# EAGLE design dfine_xb_v15_3relay (EAGLE 5.06)
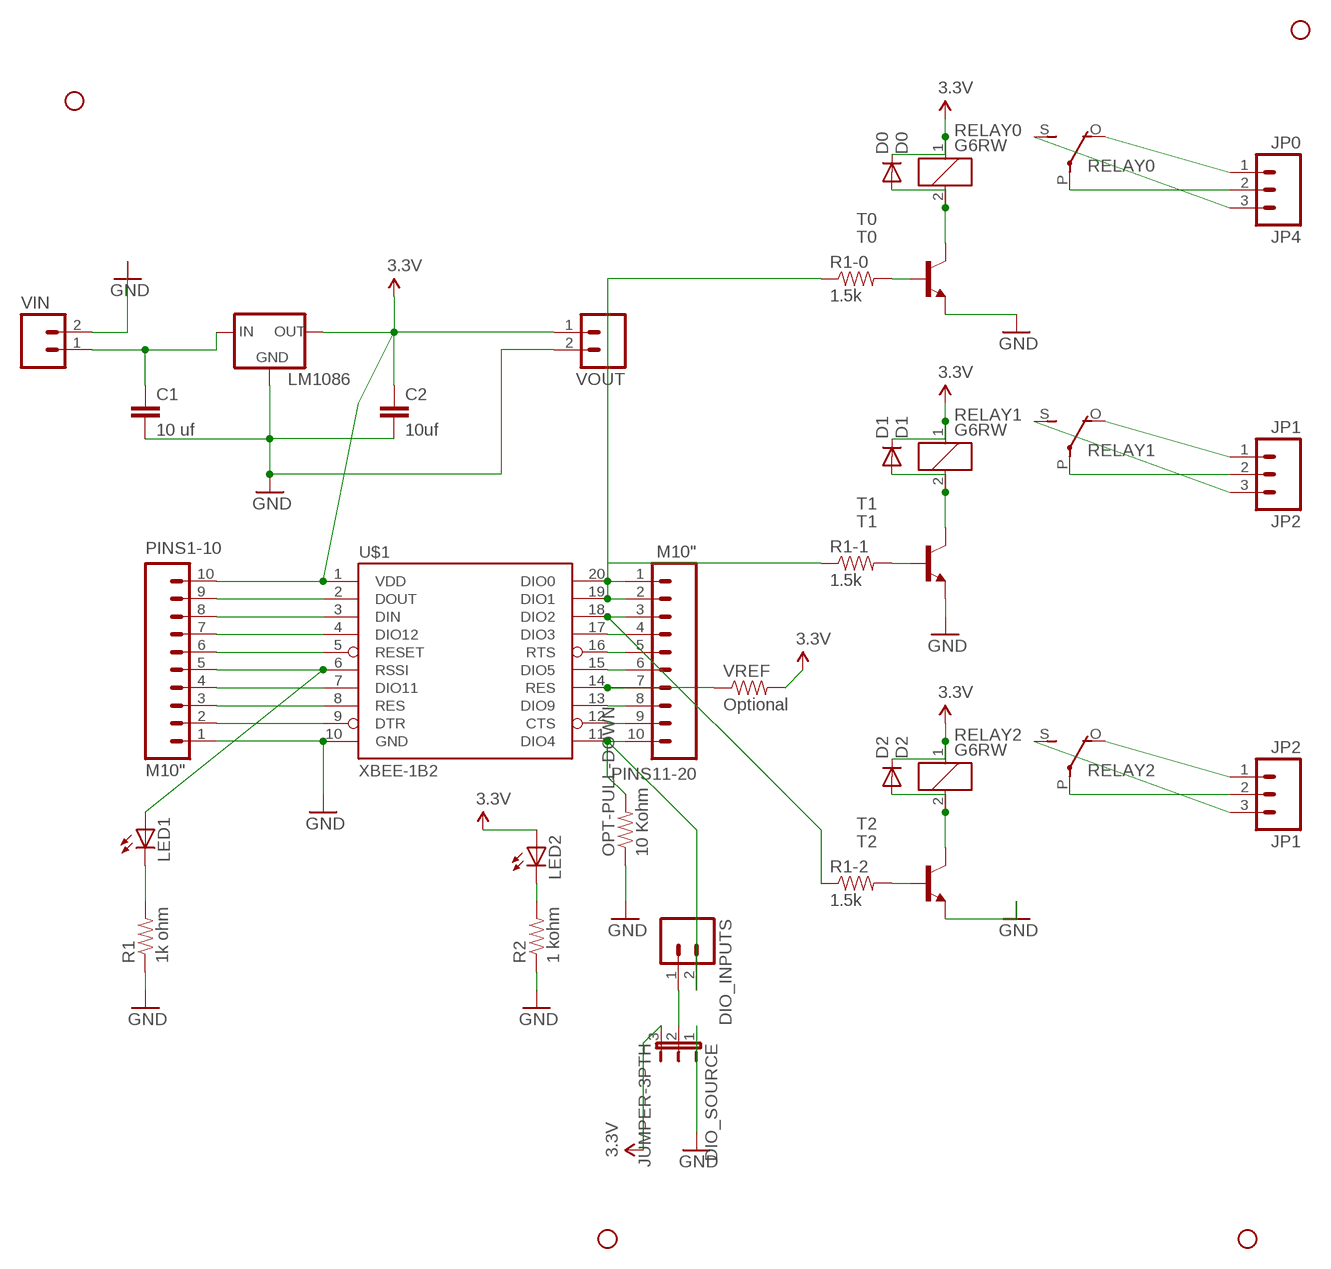
[diagram p0: schematic, sheet 1]

## Parts
C1  10 uf  CAPPTH  [CAP-PTH-SMALL]
C2  10uf  CAPPTH  [CAP-PTH-SMALL]
D0  D0  DIODEPTH  [DIODE-1N4001]
D1  D1  DIODEPTH  [DIODE-1N4001]
D2  D2  DIODEPTH  [DIODE-1N4001]
DIO_INPUTS  M023.5MM  [SCREWTERMINAL-3.5MM-2]
DIO_SOURCE  JUMPER-3PTH  [1X03]
JP1  JP2  M03SCREW  [SCREWTERMINAL-3.5MM-3]
JP2  JP1  M03SCREW  [SCREWTERMINAL-3.5MM-3]
JP4  JP0  M03SCREW  [SCREWTERMINAL-3.5MM-3]
JP5  STAND-OFF  [STAND-OFF]
JP6  STAND-OFF  [STAND-OFF]
JP7  STAND-OFF  [STAND-OFF]
JP8  STAND-OFF  [STAND-OFF]
LED1  LED3MM  [LED3MM]
LED2  LED3MM  [LED3MM]
LM1086  V_REG_78XXSINK  [TO220-IGO]
OPT-PULL-DOWN  10 Kohm  RESISTORPTH1  [AXIAL-0.3]
PINS1-10  M10"  [1X10]
PINS11-20  M10"  [1X10]
R1  1k ohm  RESISTORPTH1  [AXIAL-0.3]
R1-0  1.5k  RESISTORPTH1  [AXIAL-0.3]
R1-1  1.5k  RESISTORPTH1  [AXIAL-0.3]
R1-2  1.5k  RESISTORPTH1  [AXIAL-0.3]
R2  1 kohm  RESISTORPTH1  [AXIAL-0.3]
RELAY0  G6RW  [G6RW]
RELAY1  G6RW  [G6RW]
RELAY2  G6RW  [G6RW]
T0  T0  2N3565  [TO92]
T1  T1  2N3565  [TO92]
T2  T2  2N3565  [TO92]
U$1  XBEE-1B2  [XBEE-SILK]
VIN  M023.5MM_LOCK  [SCREWTERMINAL-3.5MM-2_LOCK]
VOUT  M023.5MM  [SCREWTERMINAL-3.5MM-2]
VREF  Optional  RESISTORPTH1  [AXIAL-0.3]

## Nets
3.3V: C2.1 D0.C D1.C D2.C DIO_SOURCE.3 LED2.A LM1086.OUT PINS1-10.10 RELAY0.1 RELAY1.1 RELAY2.1 U$1.1(VDD) VOUT.1 VREF.P$2
GND: C1.2 C2.2 DIO_SOURCE.1 LM1086.GND OPT-PULL-DOWN.P$1 PINS1-10.1 R1.P$1 R2.P$1 T0.3(E) T1.3(E) T2.3(E) U$1.10(GND) VIN.2 VOUT.2
N$1: PINS11-20.4 U$1.17(DIO3)
N$2: PINS1-10.2 U$1.9(DTR)
N$3: PINS1-10.3 U$1.8(RES)
N$4: PINS1-10.4 U$1.7(DIO11)
N$5: LED1.A PINS1-10.5 U$1.6(RSSI)
N$6: PINS1-10.6 U$1.5(RESET)
N$7: PINS1-10.7 U$1.4(DIO12)
N$8: PINS1-10.8 U$1.3(DIN)
N$9: PINS1-10.9 U$1.2(DOUT)
N$10: PINS11-20.3 R1-2.P$1 U$1.18(DIO2)
N$11: R1-0.P$2 T0.2(B)
N$12: PINS11-20.2 R1-1.P$1 U$1.19(DIO1)
N$13: PINS11-20.1 R1-0.P$1 U$1.20(DIO0)
N$14: R1-1.P$2 T1.2(B)
N$15: PINS11-20.5 U$1.16(RTS)
N$16: PINS11-20.6 U$1.15(DIO5)
N$17: PINS11-20.7 U$1.14(RES) VREF.P$1
N$18: PINS11-20.8 U$1.13(DIO9)
N$19: PINS11-20.9 U$1.12(CTS)
N$21: JP4.1 RELAY0.O(2:O)
N$22: D0.A RELAY0.2 T0.1(C)
N$23: JP4.2 RELAY0.P(2:P)
N$24: D1.A RELAY1.2 T1.1(C)
N$25: C1.1 LM1086.IN VIN.1
N$26: LED1.K(C) R1.P$2
N$27: DIO_INPUTS.2 OPT-PULL-DOWN.P$2 PINS11-20.10 U$1.11(DIO4)
N$28: LED2.K(C) R2.P$2
N$29: R1-2.P$2 T2.2(B)
N$30: JP4.3 RELAY0.S(2:S)
N$31: JP2.1 RELAY1.O(2:O)
N$32: JP2.2 RELAY1.P(2:P)
N$33: JP2.3 RELAY1.S(2:S)
N$34: JP1.1 RELAY2.O(2:O)
N$35: D2.A RELAY2.2 T2.1(C)
N$37: JP1.2 RELAY2.P(2:P)
N$38: JP1.3 RELAY2.S(2:S)
N$43: DIO_INPUTS.1 DIO_SOURCE.2

## Library data of the parts
C1 C2 = SparkFun:CAP: Capacitor Standard 0603 ceramic capacitor, and 0.1" leaded capacitor.
D0 D1 D2 = SparkFun:DIODE: Diode These are standard reverse protection diodes and small signal diodes. SMA package can handle up to about 1A. SOD-323 can handle about 200mA. What the SOD-323 package when ordering, there are some mfgs out there that are 5-pin packages.
DIO_INPUTS VIN VOUT = SparkFun:M02: Header 2 Standard 2-pin 0.1" header. Use with straight break away headers (SKU : PRT-00116), right angle break away headers (PRT-00553), swiss pins (PRT-00743), machine pins (PRT-00117), and female headers (PRT-00115). Molex polarized connector foot print use with SKU : PRT-08233 with associated crimp pins and housings.
DIO_SOURCE = SparkFun:JUMPER-3
JP1 JP2 JP4 = SparkFun:M03: Header 3 Standard 3-pin 0.1" header. Use with straight break away headers (SKU : PRT-00116), right angle break away headers (PRT-00553), swiss pins (PRT-00743), machine pins (PRT-00117), and female headers (PRT-00115). Molex polarized connector foot print use with SKU : PRT-08232 with associated crimp pins and housings.
JP5-JP8 = SparkFun:STAND-OFF: Stand Off This is the mechanical footprint for a #4 phillips button head screw. Use the keepout ring to avoid running the screw head into surrounding components. SKU : PRT-00447
LED1 LED2 = SparkFun:LED: LEDs Standard schematic elements and footprints for 5mm, 3mm, 1206, and 0603 sized LEDs. 5mm - Spark Fun Electronics SKU : COM-00529 (and others)
LM1086 = SparkFun:V_REG_78XX: Voltage Regulator Standard 7805 5V regulator. IGO (Input Ground Output). Spark Fun Electronics SKU : COM-00107
OPT-PULL-DOWN R1 R1-0 R1-1 R1-2 R2 VREF = SparkFun:RESISTOR: Resistor Basic schematic elements and footprints for 0603, 1206, and PTH 1/10th watt (small) resistors.
PINS1-10 PINS11-20 = SparkFun:M10: Header 10 Standard 10-pin 0.1" header. Use with straight break away headers (SKU : PRT-00116), right angle break away headers (PRT-00553), swiss pins (PRT-00743), machine pins (PRT-00117), and female headers (PRT-00115).
RELAY0 RELAY1 RELAY2 = relay:G6RW: RELAY 1 x switch, Omron
T0 T1 T2 = transistor-npn:2N3565: NPN Transistor
U$1 = SparkFun:XBEE-1

## Board
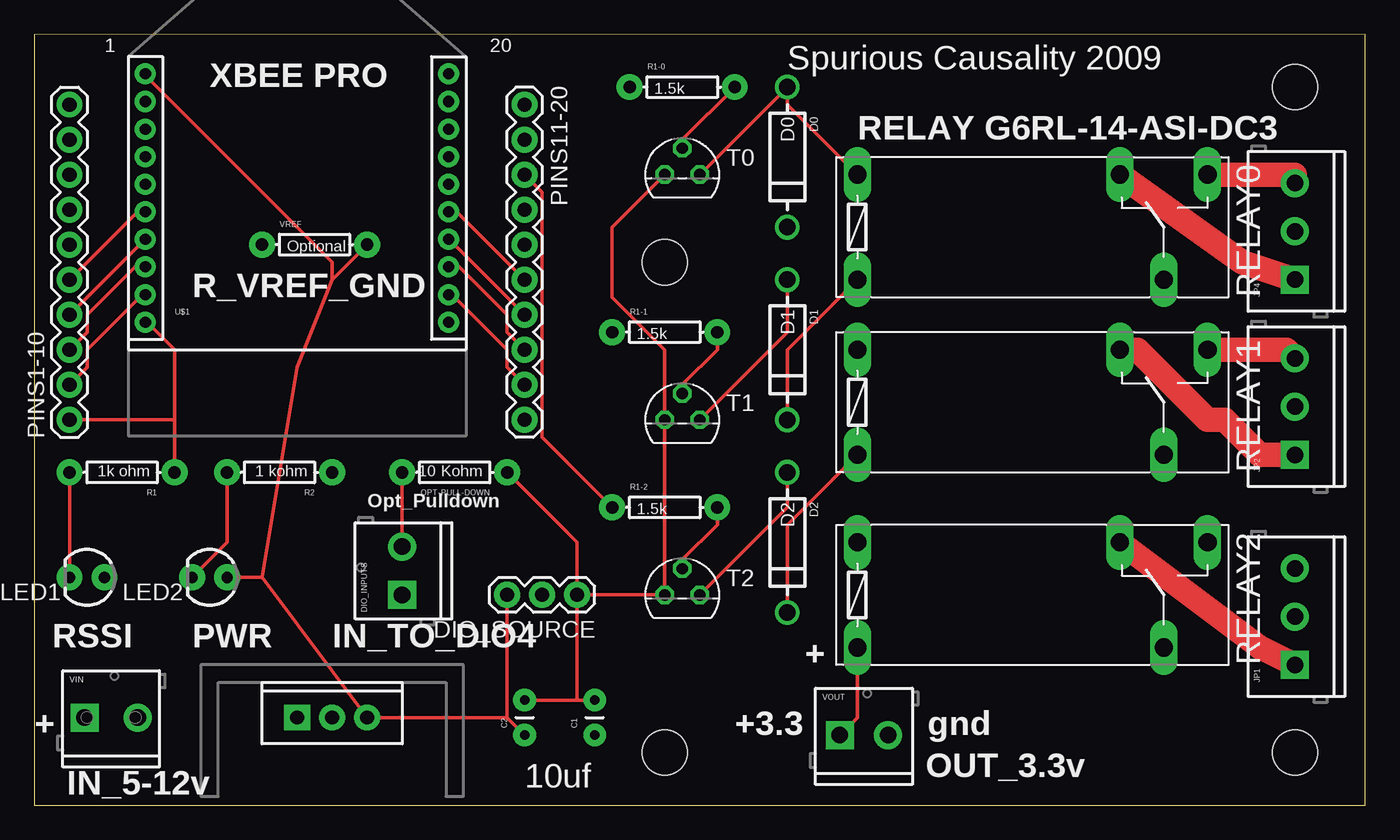
[diagram p1: board, top side]
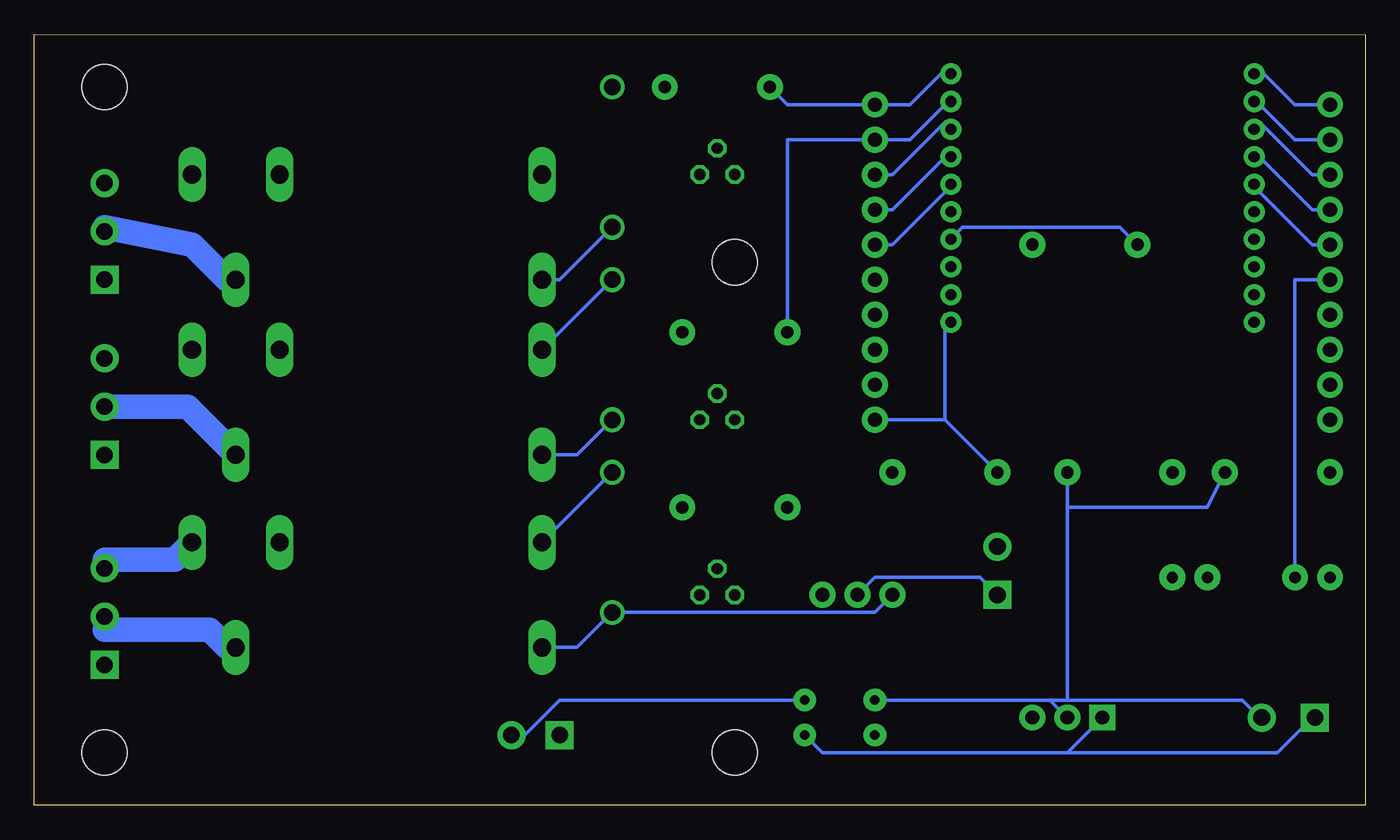
[diagram p2: board, bottom side, seen from below]

Size 96.52 x 55.88 mm. Coordinates in mm from the lower left corner, seen from the top.
Outline: 0,0 96.52,0 96.52,55.88 0,55.87 0,0
Copper layers (1*16): Top 0.035mm / dielectric 1.5mm / Bottom 0.035mm
Design rules "default": minimum track width 10mil, minimum drill 24mil, track to track 8mil, track to pad 8mil, pad to pad 8mil, via to via 8mil, smd to smd 8mil, copper to edge 40mil, drill to drill 8mil, minimum pad ring 10mil, minimum via ring 8mil, stop-mask expansion 4mil, vias tented up to drill 0mil, thermal gap 10mil

### Footprints (pad centres in the part's own frame; a part is rotated, then mirrored left to right if it is on the bottom)
CAP-PTH-SMALL = drill 0.7 pad 1.651 round: 1 0,0; 2 2.54,0
DIODE-1N4001 = drill 1.2 round: A -5.08,0; C 5.08,0
SCREWTERMINAL-3.5MM-2 = drill 1.2 pad 2.032 square: 1 0,0 | drill 1.2 pad 2.032 round: 2 3.5,0
1X03 = drill 1.016 pad 1.88 round: 1 0,0; 2 2.54,0; 3 5.08,0
SCREWTERMINAL-3.5MM-3 = drill 1.2 pad 2.032 square: 1 0,0 | drill 1.2 pad 2.032 round: 2 3.5,0; 3 7,0
STAND-OFF = hole 3.302: 0,0
LED3MM = drill 0.813 pad 1.88 round: A -1.27,0; K 1.27,0
TO220-IGO = drill 1 pad 1.88 round: GND 0,0; OUT 2.54,0 | drill 1 pad 1.88 square: IN -2.54,0
AXIAL-0.3 = drill 0.9 pad 1.88 round: P$1 -3.81,0; P$2 3.81,0
1X10 = drill 1.016 pad 1.88 round: 1 0,0; 2 2.54,0; 3 5.08,0; 4 7.62,0; 5 10.16,0; 6 12.7,0; 7 15.24,0; 8 17.78,0; 9 20.32,0; 10 22.86,0
G6RW = drill 1.321 long: 1 -12.7,-3.81; 2 -12.7,3.81; O 6.35,3.81; P 9.525,-3.81; S 12.7,3.81
TO92 = drill 0.813 octagon: 1 1.27,0; 2 0,1.905; 3 -1.27,0
XBEE-SILK = drill 0.8 pad 1.524 round: 1 -11,20; 2 -11,18; 3 -11,16; 4 -11,14; 5 -11,12; 6 -11,10; 7 -11,8; 8 -11,6; 9 -11,4; 10 -11,2; 11 11,2; 12 11,4; 13 11,6; 14 11,8; 15 11,10; 16 11,12; 17 11,14; 18 11,16; 19 11,18; 20 11,20
SCREWTERMINAL-3.5MM-2_LOCK = drill 1.2 pad 2.032 square: 1 -0.178,0 | drill 1.2 pad 2.032 round: 2 3.678,0

### Placement (x,y rotation side)
C1  40.64,5.08 90 top
C2  35.56,5.08 90 top
D0  54.61,46.99 270 top
D1  54.61,33.02 270 top
D2  54.61,19.05 270 top
DIO_INPUTS  26.67,15.24 90 top
DIO_SOURCE  39.37,15.24 180 top
JP1  91.44,10.16 90 top
JP2  91.44,25.4 90 top
JP4  91.44,38.1 90 top
JP5  45.72,39.37 0 top
JP6  91.44,52.07 0 top
JP7  45.72,3.81 0 top
JP8  91.44,3.81 0 top
LED1  3.81,16.51 180 top
LED2  12.7,16.51 180 top
LM1086  21.59,6.35 0 top
OPT-PULL-DOWN  30.48,24.13 180 top
PINS1-10  2.54,27.94 90 top
PINS11-20  35.56,50.8 270 top
R1  6.35,24.13 180 top
R1-0  46.99,52.07 0 top
R1-1  45.72,34.29 0 top
R1-2  45.72,21.59 0 top
R2  17.78,24.13 180 top
RELAY0  72.39,41.91 0 top
RELAY1  72.39,29.21 0 top
RELAY2  72.39,15.24 0 top
T0  46.99,45.72 0 top
T1  46.99,27.94 0 top
T2  46.99,15.24 0 top
U$1  19.05,33.02 0 top
VIN  3.81,6.35 0 top
VOUT  58.42,5.08 0 top
VREF  20.32,40.64 0 top

### Tracks (layer width: path | path; a pad name or v marks a point on that pad's centre or on a via)
3.3V
  Top 0.254: VOUT.1 59.69,6.35 RELAY2.1 | RELAY1.1 54.61,20.32 D2.C | RELAY0.1 54.61,33.02 D1.C | 34.29,6.35 C2.1 | 34.29,6.35 DIO_SOURCE.3 | 16.51,16.51 LM1086.OUT 34.29,6.35 | LED2.A 16.51,16.51 | 21.59,38.1 19.05,31.75 16.51,16.51 | 21.59,38.1 VREF.P$2 | 21.59,38.1 21.59,39.37 7.62,53.34 U$1.1
  Bottom 0.254: D0.C 58.42,38.1 RELAY0.1 | D1.C 57.15,25.4 RELAY1.1 | RELAY2.1 57.15,11.43 D2.C 35.56,13.97 DIO_SOURCE.3 | PINS1-10.10 5.08,50.8 7.62,53.34 U$1.1
GND
  Top 0.254: DIO_SOURCE.1 T2.3 T1.3 45.72,33.02 41.91,36.83 41.91,41.91 T0.3 | OPT-PULL-DOWN.P$1 39.37,19.05 DIO_SOURCE.1 | R1.P$1 10.16,27.94 | 10.16,27.94 10.16,33.02 7.62,35.56 U$1.10 | 10.16,27.94 PINS1-10.1 | 39.37,7.62 C1.2 | C2.2 39.37,7.62 | 39.37,7.62 DIO_SOURCE.1
  Bottom 0.254: 22.86,7.62 LM1086.GND | 22.86,7.62 C2.2 | 21.59,7.62 21.59,21.59 | 21.59,21.59 R2.P$1 | 21.59,7.62 22.86,7.62 | C1.2 58.42,7.62 60.96,5.08 VOUT.2 | 21.59,7.62 8.89,7.62 7.62,6.35 VIN.2 | R1.P$1 11.43,21.59 21.59,21.59
N$1
  Bottom 0.254: PINS11-20.4 34.29,43.18 30.48,46.99 U$1.17
N$2
  Top 0.254: PINS1-10.2 3.81,31.75 3.81,33.02 7.62,36.83 U$1.9
N$3
  Top 0.254: PINS1-10.3 3.81,34.29 3.81,35.56 7.62,39.37 U$1.8
  Bottom 0.254: U$1.8 7.62,39.37
N$4
  Top 0.254: PINS1-10.4 7.62,40.64 U$1.7
N$5
  Top 0.254: PINS1-10.5 7.62,43.18 U$1.6
  Bottom 0.254: LED1.A 5.08,38.1 PINS1-10.5
N$6
  Bottom 0.254: PINS1-10.6 3.81,40.64 7.62,44.45 U$1.5
N$7
  Bottom 0.254: PINS1-10.7 3.81,43.18 7.62,46.99 U$1.4
N$8
  Bottom 0.254: PINS1-10.8 3.81,45.72 7.62,49.53 U$1.3
N$9
  Bottom 0.254: PINS1-10.9 5.08,48.26 7.62,50.8 U$1.2
N$10
  Top 0.254: R1-2.P$1 36.83,26.67 36.83,44.45 PINS11-20.3
  Bottom 0.254: PINS11-20.3 34.29,45.72 30.48,49.53 U$1.18
N$11
  Top 0.254: R1-0.P$2 46.99,48.26 T0.2
N$12
  Bottom 0.254: U$1.19 30.48,50.8 33.02,48.26 PINS11-20.2 41.91,48.26 R1-1.P$1
N$13
  Bottom 0.254: U$1.20 30.48,53.34 33.02,50.8 PINS11-20.1 41.91,50.8 R1-0.P$1
N$14
  Top 0.254: R1-1.P$2 49.53,33.02 46.99,30.48 T1.2
N$15
  Bottom 0.254: PINS11-20.5 34.29,40.64 30.48,44.45 U$1.16
N$16
  Top 0.254: PINS11-20.6 30.48,43.18 U$1.15
N$17
  Top 0.254: PINS11-20.7 30.48,40.64 U$1.14
  Bottom 0.254: VREF.P$1 17.78,41.91 29.21,41.91 30.48,40.64 U$1.14
N$18
  Top 0.254: PINS11-20.8 34.29,34.29 34.29,35.56 30.48,39.37 U$1.13
N$19
  Top 0.254: PINS11-20.9 34.29,31.75 34.29,33.02 30.48,36.83 U$1.12
N$21
  Top 1.778: RELAY0.O 87.63,39.37 JP4.1
N$22
  Top 0.254: T0.1 D0.A 54.61,50.8 RELAY0.2
N$23
  Bottom 0.254: RELAY0.P 82.55,38.1 | 91.44,41.91 JP4.2
  Bottom 1.778: 82.55,38.1 85.09,40.64 91.44,41.91
N$24
  Top 0.254: T1.1 54.61,34.29 D1.A
  Bottom 0.254: D1.A RELAY1.2
N$25
  Bottom 0.254: C1.1 39.37,3.81 21.59,3.81 | 21.59,3.81 LM1086.IN | 21.59,3.81 6.35,3.81 3.81,6.35 VIN.1
N$26
  Top 0.254: LED1.K R1.P$2
N$27
  Top 0.254: DIO_INPUTS.2 OPT-PULL-DOWN.P$2
  Bottom 0.254: 30.48,27.94 30.48,35.56 U$1.11 | 30.48,27.94 PINS11-20.10 | OPT-PULL-DOWN.P$2 30.48,27.94
N$28
  Top 0.254: LED2.K 13.97,19.05 R2.P$2
N$29
  Top 0.254: R1-2.P$2 49.53,20.32 46.99,17.78 T2.2
N$30
  Top 0.254: 91.44,45.72 JP4.3
  Top 1.778: RELAY0.S 91.44,45.72
N$31
  Top 1.778: RELAY1.O 80.01,33.02 85.09,27.94 86.36,27.94 88.9,25.4 JP2.1
N$32
  Bottom 1.778: JP2.2 85.42,28.9 RELAY1.P
N$33
  Top 1.778: RELAY1.S 90.82,33.02 JP2.3
N$34
  Top 1.778: RELAY2.O 88.9,11.43 JP1.1
N$35
  Top 0.254: T2.1 54.61,21.59 D2.A
  Bottom 0.254: D2.A RELAY2.2
N$37
  Bottom 0.254: 91.44,12.7 JP1.2
  Bottom 1.778: 91.44,12.7 83.82,12.7 82.55,11.43 RELAY2.P
N$38
  Bottom 0.254: 91.44,17.78 JP1.3
  Bottom 1.778: RELAY2.S 86.36,17.78 91.44,17.78
N$43
  Bottom 0.254: DIO_SOURCE.2 35.56,16.51 27.94,16.51 DIO_INPUTS.1

### Text on the board
tPlace: 1 | 20 | Spurious Causality 2009 | XBEE PRO | RELAY G6RL-14-ASI-DC3 | R_VREF_GND | Opt_Pulldown | RSSI | PWR | IN_TO_DIO4 | + | + | +3.3 | gnd | OUT_3.3v | IN_5-12v | 10uf